# EAGLE design SparkFun_Tri_Axis_Accel_Breakout-H3LIS331DL (EAGLE 7.7.0)
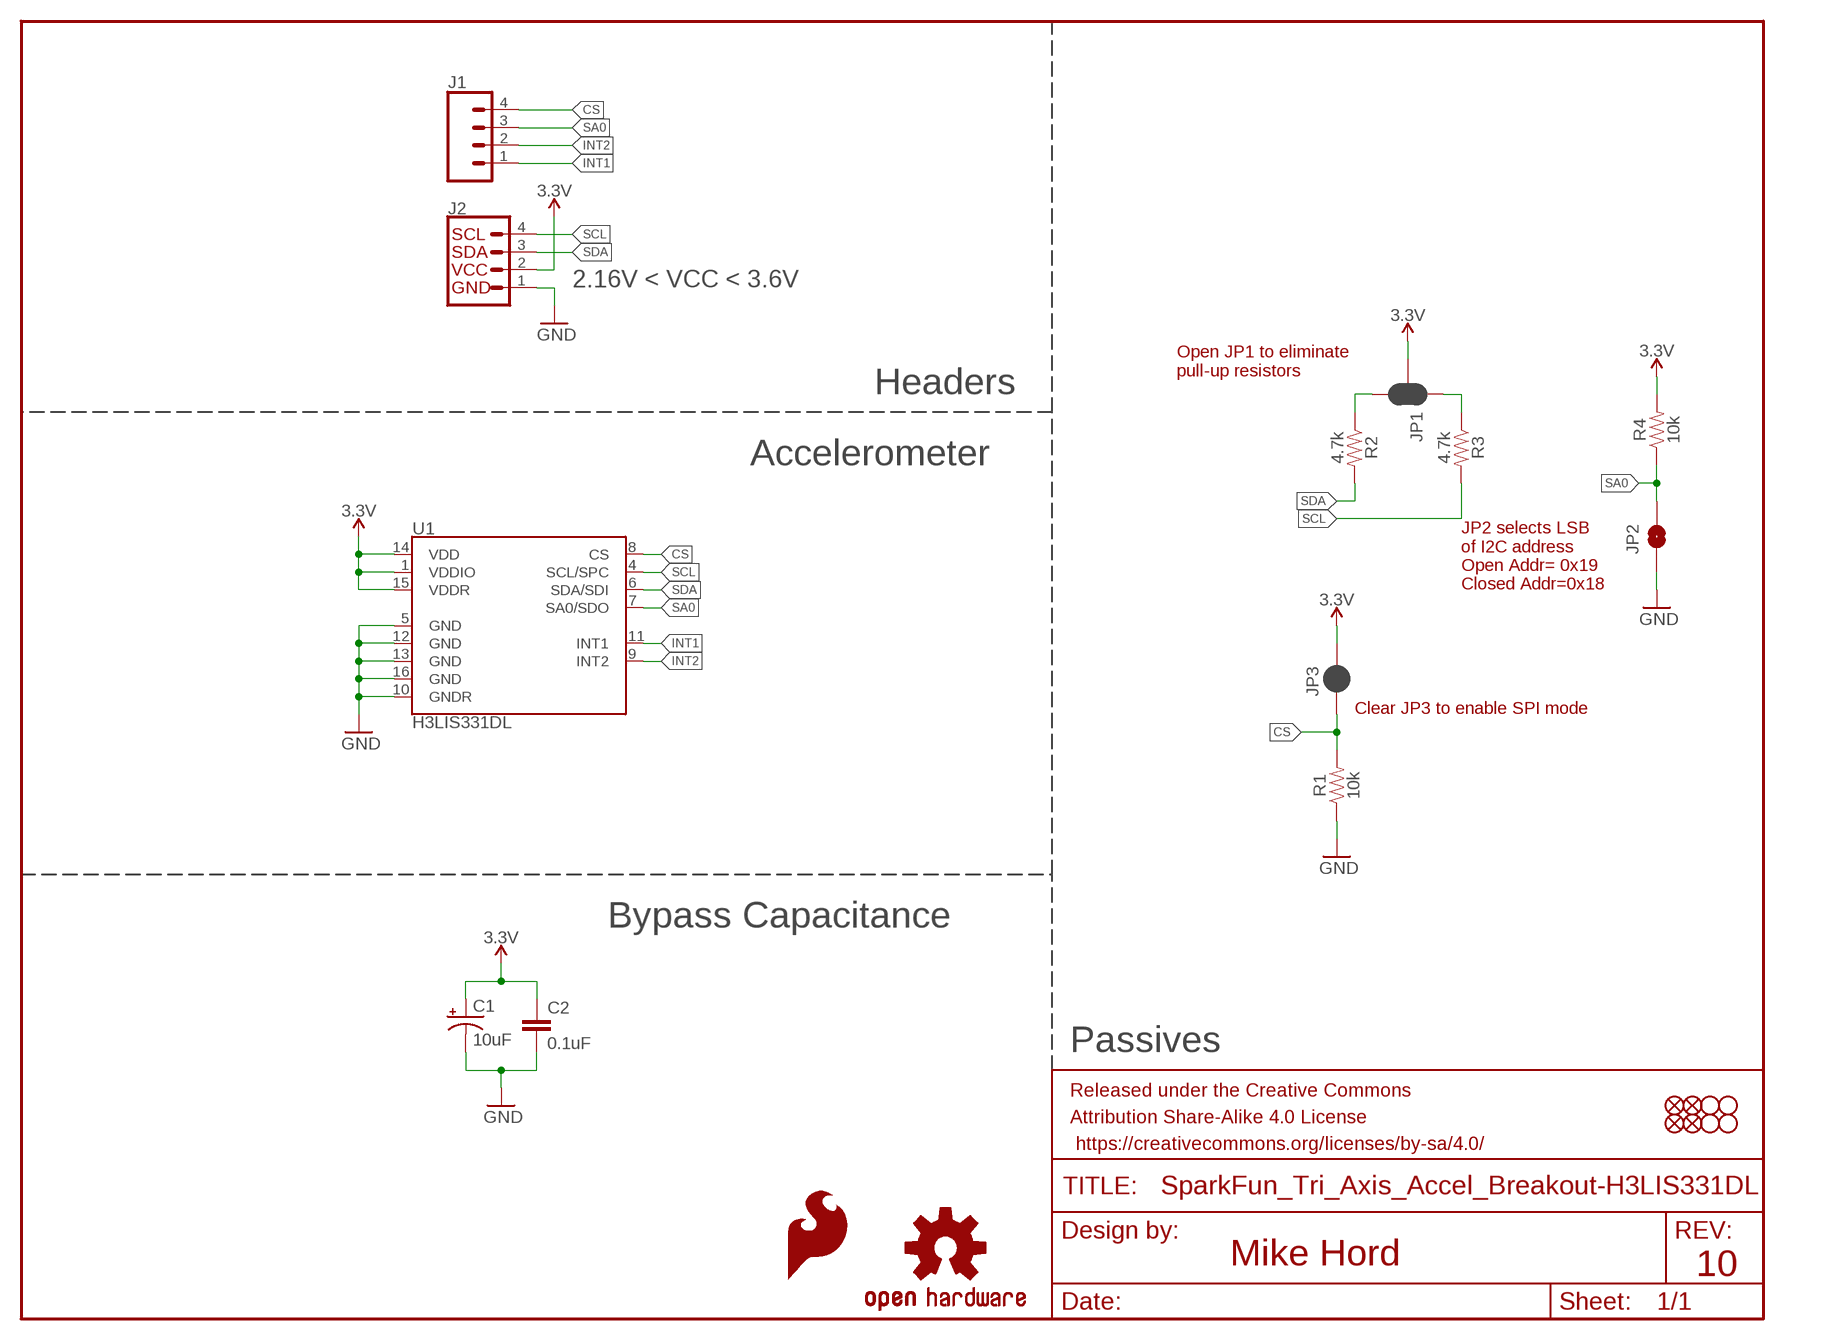
[diagram p0: schematic, sheet 1]

## Parts
C1  10uF  10UF-POLAR-EIA3216-16V-10%(TANT)  [EIA3216]
C2  0.1uF  0.1UF-0603-25V-5%  [0603]
FRAME1  FRAME-LETTER  [CREATIVE_COMMONS]
J1  CONN_04  [1X04]
J2  I2C_STANDARD  [1X04]
JP1  JUMPER-SMT_3_2-NC_PASTE_NO-SILK  [SMT-JUMPER_3_2-NC_PASTE_NO-SILK]
JP2  JUMPER-SMT_2_NO_NO-SILK  [SMT-JUMPER_2_NO_NO-SILK]
JP3  JUMPER-SMT_2_NC_PASTE_NO-SILK  [SMT-JUMPER_2_NC_PASTE_NO-SILK]
JP4  FIDUCIAL1X2  [FIDUCIAL-1X2]
JP5  FIDUCIAL1X2  [FIDUCIAL-1X2]
JP6  FIDUCIAL1X2  [FIDUCIAL-1X2]
JP7  FIDUCIAL1X2  [FIDUCIAL-1X2]
JP8  STAND-OFF  [STAND-OFF]
JP9  STAND-OFF  [STAND-OFF]
JP10  STAND-OFF  [STAND-OFF]
JP11  STAND-OFF  [STAND-OFF]
LOGO1  SFE_LOGO_FLAME.1_INCH  [SFE_LOGO_FLAME_.1]
LOGO2  OSHW-LOGOS  [OSHW-LOGO-S]
R1  10k  10KOHM-0603-1/10W-1%  [0603]
R2  4.7k  4.7KOHM-0603-1/10W-1%  [0603]
R3  4.7k  4.7KOHM-0603-1/10W-1%  [0603]
R4  10k  10KOHM-0603-1/10W-1%  [0603]
U1  H3LIS331DL  [LGA-16-3X3]

## Nets
3.3V: C1.+ C2.1 J2.2 JP1.2 JP3.2 R4.2 U1.1(VDDIO) U1.14(VDD) U1.15(VDDR)
CS: J1.4 JP3.1 R1.2 U1.8(CS)
GND: C1.- C2.2 J2.1 JP2.1 R1.1 U1.5(GND) U1.10(GNDR) U1.12(GND) U1.13(GND) U1.16(GND)
INT1: J1.1 U1.11(INT1)
INT2: J1.2 U1.9(INT2)
N$1: JP1.1 R3.1
N$2: JP1.3 R2.1
SA0: J1.3 JP2.2 R4.1 U1.7(SA0/SDO)
SCL: J2.4 R3.2 U1.4(SCL/SPC)
SDA: J2.3 R2.2 U1.6(SDA/SDI)

## Notes on the sheet
- 2.16V < VCC < 3.6V
- Open JP1 to eliminate
  pull-up resistors
- Headers
- Accelerometer
- JP2 selects LSB
  of I2C address
  Open Addr= 0x19
  Closed Addr=0x18
- Clear JP3 to enable SPI mode
- Bypass Capacitance
- Passives
- Mike Hord
- 10

## Library data of the parts
C1 = SparkFun-Capacitors:10UF-POLAR: 10.0µF polarized capacitors A capacitor is a passive two-terminal electrical component used to store electrical energy temporarily in an electric field.; PROD_ID: CAP-00811
C2 = SparkFun-Capacitors:0.1UF: 0.1µF ceramic capacitors A capacitor is a passive two-terminal electrical component used to store electrical energy temporarily in an electric field.; PROD_ID: CAP-08604
FRAME1 = SparkFun-Aesthetics:FRAME-LETTER: Schematic Frame - Letter Standard 8.5x11 US Letter frame
J1 = SparkFun-Connectors:CONN_04: Multi connection point. Often used as Generic Header-pin footprint for 0.1 inch spaced/style header connections On any of the 0.1 inch spaced packages, you can populate with these: Break Away Headers - Straight <https://www.sparkfun.com/products/116> (PRT-00116) Break Away Male Headers - Right Angle <https://www.sparkfun.com/products/553> (PRT-00553) Female Headers <https://www.sparkfun.com/products/115> (PRT-00115) Break Away Headers - Machine Pin <https://www.sparkfun.com/products/117> (PRT-00117) Break Away Female Headers - Swiss Machine Pin <https://www.sparkfun.com/products/743> (PRT-00743) For SCREWTERMINALS and SPRING TERMINALS visit here: Screw Terimnals on SparkFun.com <https://www.sparkfun.com/search/results?term=Screw+Terminals> (5mm/3.5mm/2.54mm spacing) This device is also useful as a general connection point to wire up your design to another part of your project. Our various solder wires solder well into these plated through hole pads. Hook-Up Wire - Assortment (Stranded, 22 AWG) <https://www.sparkfun.com/products/11375> (PRT-11375) Hook-Up Wire - Assortment (Solid Core, 22 AWG) <https://www.sparkfun.com/products/11367> (PRT-11367) View the entire wire category on our website here <https://www.sparkfun.com/categories/141> Special notes: Molex polarized connector foot print use with SKU : PRT-08231 with associated crimp pins and housings. 1MM SMD Version SKU: PRT-10208; PROD_ID: CONN-09696
J2 = SparkFun-Connectors:I2C_STANDARD: SparkFun I2C Standard Pinout Header SparkFun has standardized on a pinout for all I2C based sensor breakouts. This pinout allows I2C boards to be plugged directly into the headers on Arduino Uno compatible boards, and to be daisy chained easily. Example SparkFun Products: SparkFun Atmospheric Sensor Breakout - BME280 <https://www.sparkfun.com/products/13676> SparkFun Altitude/Pressure Sensor Breakout - MPL3115A2 <https://www.sparkfun.com/products/11084> SparkFun TOF Range Finder Sensor - VL6180 <https://www.sparkfun.com/products/12785>
JP1 = SparkFun-Jumpers:JUMPER-SMT_3_2-NC_PASTE: Normally closed solder jumper (2 of 2 connections) This jumper has an aperture in the stencil to allow solder paste to bridge both connections. Both connections are normally closed (NC). Wick off the solder to open the connection(s). Reapply solder to reclose the connection(s).
JP2 = SparkFun-Jumpers:JUMPER-SMT_2_NO: Normally open jumper This jumper has two pads in close proximity to each other. Apply solder to close the connection. Round pads are easier to solder for beginners, but are a lot larger. SparkFun Product that uses the round pads: SparkFun EL Sequencer <https://www.sparkfun.com/products/12781>
JP3 = SparkFun-Jumpers:JUMPER-SMT_2_NC_PASTE: Normally closed solder jumper This jumper has an aperture in the stencil to allow solder paste to bridge the split in the wire so it's normally closed (NC). Wick off the solder to open the connection. Reapply solder to reclose the connection.
JP4-JP7 = SparkFun:FIDUCIAL: Fiducial Alignment Points Various fiducial points for machine vision alignment.
JP8-JP11 = SparkFun:STAND-OFF: Stand Off This is the mechanical footprint for a #4 phillips button head screw. Use the keepout ring to avoid running the screw head into surrounding components. SKU : PRT-00447
LOGO1 = SparkFun-Aesthetics:SFE_LOGO_FLAME: SparkFun Flame Logo This is the SparkFun flame logo. The logo on the schematic will always be the same size; the package variant is the height of the flame. Default layer for the logo on the board is tSilk.
LOGO2 = SparkFun-Aesthetics:OSHW-LOGO: Open-Source Hardware (OSHW) Logo This logo indicates the piece of hardware it is found on incorporates a OSHW license and/or adheres to the definition of open source hardware found here: http://freedomdefined.org/OSHW
R1 R4 = SparkFun-Resistors:10KOHM: 10kΩ resistor A resistor is a passive two-terminal electrical component that implements electrical resistance as a circuit element. Resistors act to reduce current flow, and, at the same time, act to lower voltage levels within circuits. - Wikipedia; PROD_ID: RES-00824
R2 R3 = SparkFun-Resistors:4.7KOHM: 4.7kΩ resistor A resistor is a passive two-terminal electrical component that implements electrical resistance as a circuit element. Resistors act to reduce current flow, and, at the same time, act to lower voltage levels within circuits. - Wikipedia; PROD_ID: RES-07857
U1 = SparkFun-Sensors:H3LIS331DL; PROD_ID: IC-13786

## Board
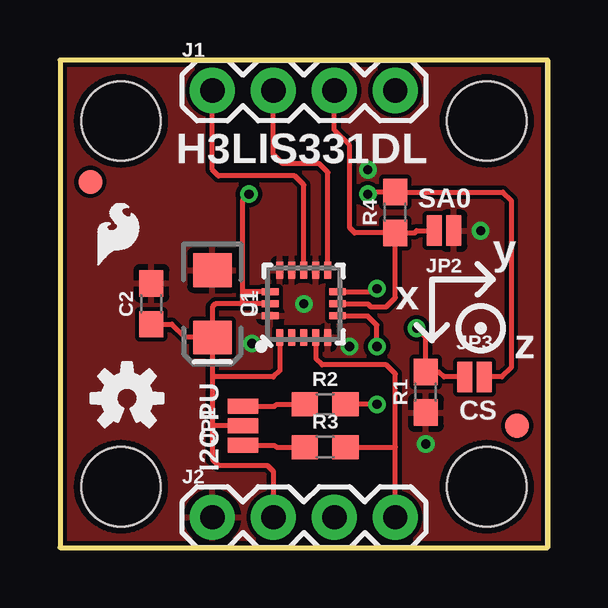
[diagram p1: board, top side]
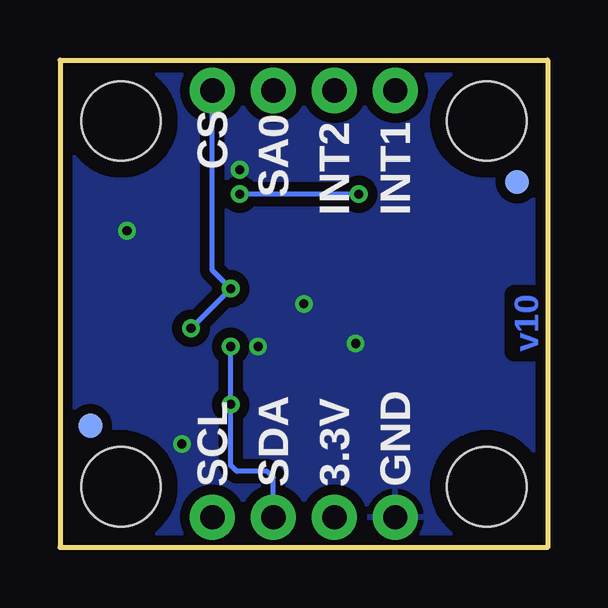
[diagram p2: board, bottom side, seen from below]

Size 20.32 x 20.32 mm. Coordinates in mm from the lower left corner, seen from the top.
Outline: 0,0 20.32,0 20.32,20.32 0,20.32 0,0
Copper layers (1*16): Top 0.035mm / dielectric 1.5mm / Bottom 0.035mm
Design rules "SparkFun-2-layer-TIGHT": minimum track width 7mil, minimum drill 15mil, track to track 7mil, track to pad 7mil, pad to pad 7mil, via to via 7mil, smd to smd 7mil, copper to edge 7mil, drill to drill 7mil, minimum pad ring 7mil, minimum via ring 7mil, stop-mask expansion 4mil, vias tented up to drill 25mil, thermal gap 10mil
tRestrict: 1 lines

### Footprints (pad centres in the part's own frame; a part is rotated, then mirrored left to right if it is on the bottom)
EIA3216 = smd 1.4 x 1.6: + 1.4,0; - -1.4,0
0603 = smd 1.1 x 1: 1 -0.85,0; 2 0.85,0
1X04 = drill 1.016 pad 1.88: 1 0,0; 2 2.54,0; 3 5.08,0; 4 7.62,0
SMT-JUMPER_3_2-NC_PASTE_NO-SILK = smd 0.635 x 1.27: 1 -0.813,0; 2 0,0; 3 0.813,0
SMT-JUMPER_2_NO_NO-SILK = smd 0.635 x 1.27: 1 -0.406,0; 2 0.406,0
SMT-JUMPER_2_NC_PASTE_NO-SILK = smd 0.635 x 1.27: 1 -0.406,0; 2 0.406,0
FIDUCIAL-1X2 = smd 1 x 1: 1 0,0
STAND-OFF = hole 3.302: 0,0
LGA-16-3X3 = smd 0.7 x 0.28: 1 -1.4,1; 2 -1.4,0.5; 3 -1.4,0; 4 -1.4,-0.5; 5 -1.4,-1; 9 1.4,-1; 10 1.4,-0.5; 11 1.4,0; 12 1.4,0.5; 13 1.4,1 | smd 0.28 x 0.7: 6 -0.5,-1.4; 7 0,-1.4; 8 0.5,-1.4; 14 0.5,1.4; 15 0,1.4; 16 -0.5,1.4

### Placement (x,y rotation side)
C1  6.35,10.16 270 top
C2  3.81,10.16 90 top
FRAME1  1.27,-19.05 0 top  (outside the outline)
J1  6.35,19.05 0 top
J2  6.35,1.27 0 top
JP1  7.62,5.08 90 top
JP2  16,13.21 180 top
JP3  17.27,7.11 0 top
JP4  1.27,15.24 0 top
JP5  1.27,15.24 0 bottom
JP6  19.05,5.08 0 top
JP7  19.05,5.08 0 bottom
JP8  17.78,2.54 0 top
JP9  2.54,2.54 0 top
JP10  17.78,17.78 0 top
JP11  2.54,17.78 0 top
LOGO1  1.27,11.43 0 top
LOGO2  2.79,6.22 0 top
R1  15.24,6.48 90 top
R2  11.05,5.97 0 top
R3  11.05,4.19 0 top
R4  13.97,13.97 90 top
U1  10.16,10.16 90 top

### Tracks (layer width: path | path; a pad name or v marks a point on that pad's centre or on a via)
3.3V  (via drill 0.38)
  Top 0.203: C1.+ 6.35,7.11 | 6.35,7.11 6.35,5.08 | 6.35,5.08 6.35,3.68 6.6,3.43 8.64,3.43 8.89,3.17 J2.2 | JP1.2 6.35,5.08 | U1.1 9.16,7.38 8.89,7.11 6.35,7.11 | U1.15 7.62,10.16 | 7.62,10.16 6.48,10.16 6.35,10.03 C1.+ | U1.14 7.63,10.66 7.62,10.67 | 7.62,10.16 7.62,10.67 | 7.62,10.67 7.62,14.48 v7.87,14.73 | v12.83,14.73 12.91,14.82 R4.2 18.45,14.82 18.8,14.48 18.8,7.49 18.41,7.11 JP3.2 | C2.1 4.66,9.31 5.21,8.76 C1.+
  Bottom 0.203: v7.87,14.73 v12.83,14.73
CS  (via drill 0.38)
  Top 0.203: U1.8 13.07,10.66 v13.21,10.79 | JP3.1 16,7.11 15.79,7.33 R1.2 15.24,8.76 v14.86,9.14
  Bottom 0.203: J1.4 13.97,11.56 v13.21,10.79 v14.86,9.14
GND  (via drill 0.38)
  other vias: 10.16,10.16 12.06,8.38 8,8.51 17.53,13.21 15.24,4.32 12.83,15.75
  pour Top: 0,20.32 0,0 20.32,0 20.32,20.32
  pour Bottom (isolate 0.406): 0,20.32 0,0 20.32,0 20.32,20.32
INT1
  Top 0.203: U1.11 10.16,15.11 9.78,15.49 6.6,15.49 6.35,15.75 J1.1
INT2
  Top 0.203: U1.9 11.16,15.64 10.79,16 9.27,16 8.89,16.38 J1.2
N$1
  Top 0.203: JP1.1 8.94,4.27 9.02,4.19 R3.1
N$2
  Top 0.203: JP1.3 8.94,5.89 9.02,5.97 R2.1
SA0
  Top 0.203: U1.7 12.83,10.16 12.95,10.03 13.59,10.03 13.97,10.41 R4.1 | R4.1 14.77,13.12 14.86,13.21 JP2.2 | R4.1 12.28,13.12 12.06,13.34 12.06,16.76 11.43,17.4 J1.3
SCL
  Top 0.203: J2.4 13.97,4.19 | 13.97,4.19 13.97,7.24 13.59,7.62 10.92,7.62 10.66,7.88 U1.4 | R3.2 13.97,4.19
SDA  (via drill 0.38)
  Top 0.203: v13.21,5.97 R2.2 | v13.21,8.38 13.21,9.27 12.83,9.65 U1.6
  Bottom 0.203: J2.3 11.43,2.92 11.68,3.17 12.95,3.17 13.21,3.43 v13.21,5.97 v13.21,8.38

### Text on the board
Bottom: v10
tPlace: H3LIS331DL | SA0 | y | x | z | CS | I2C PU
bPlace: CS | SA0 | INT1 | INT2 | GND | 3.3V | SDA | SCL
Measures: typ. | Units in inches | typ.
tDocu: Mike Hord